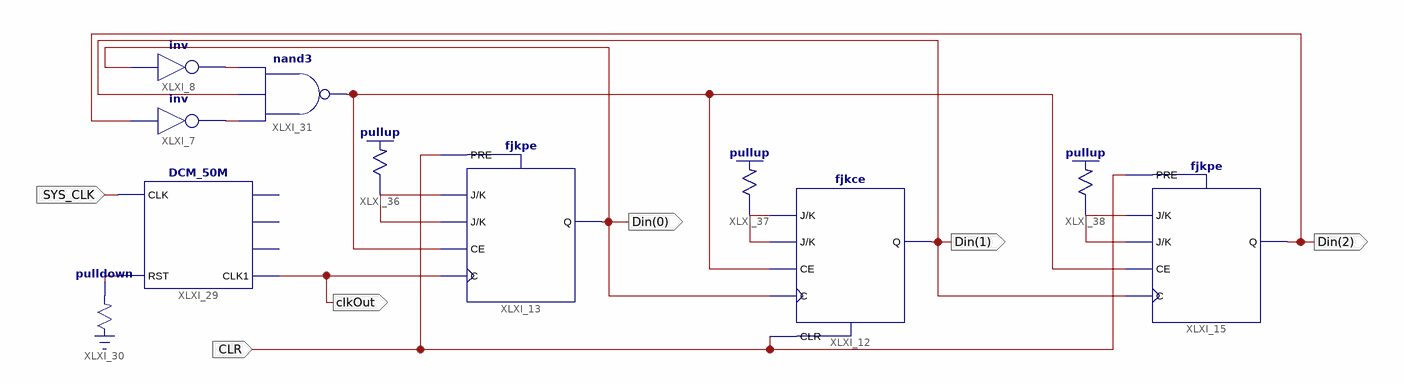
[diagram p0: schematic sheet 1]
// Xilinx ISE schematic Experiment4.sch (spartan3e) as structural Verilog: 11 symbols, 6 ports
module Experiment4 (
  input  CLR,
  input  SYS_CLK,
  output [2:0] Din,
  output clkOut
);

  wire XLXN_61, XLXN_64, XLXN_65, XLXN_69, XLXN_70, XLXN_72, XLXN_74;

  fjkpe XLXI_13 (.C(clkOut), .CE(XLXN_69), .J(XLXN_70), .K(XLXN_70), .PRE(CLR), .Q(Din[0]));
  fjkpe XLXI_15 (.C(Din[1]), .CE(XLXN_69), .J(XLXN_74), .K(XLXN_74), .PRE(CLR), .Q(Din[2]));
  DCM_50M XLXI_29 (.CLK(SYS_CLK), .RST(XLXN_61), .CLK1(clkOut));  // open: CLK1M, CLK10k, CLK1k
  \pulldown  XLXI_30 (.O(XLXN_61));
  fjkce XLXI_12 (.C(Din[0]), .CE(XLXN_69), .CLR(CLR), .J(XLXN_72), .K(XLXN_72), .Q(Din[1]));
  nand XLXI_31 (XLXN_69, XLXN_64, Din[1], XLXN_65);
  not XLXI_7 (XLXN_64, Din[2]);
  not XLXI_8 (XLXN_65, Din[0]);
  \pullup  XLXI_36 (.O(XLXN_70));
  \pullup  XLXI_37 (.O(XLXN_72));
  \pullup  XLXI_38 (.O(XLXN_74));
endmodule
